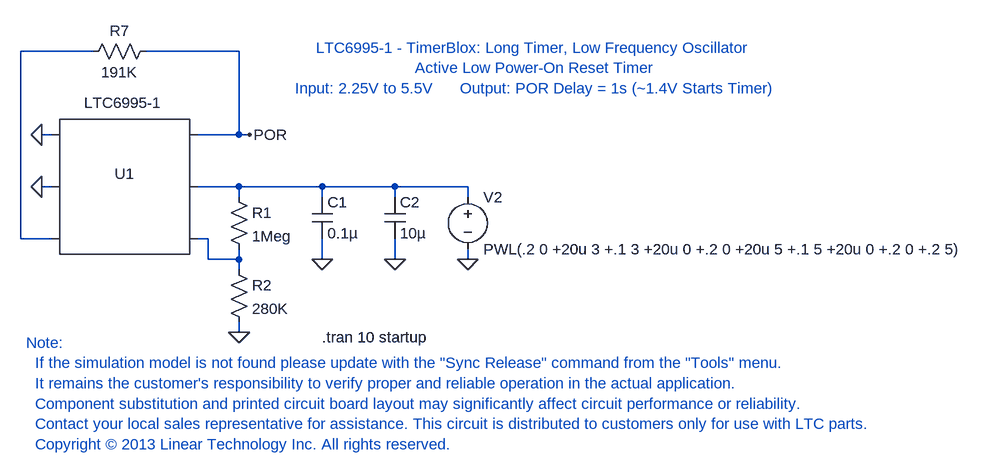
[diagram p0: schematic LTC6995-1_F12.asc]
LTC6995-1_F12.asc, the LTspice schematic file:
Version 4
SHEET 1 1636 680
WIRE 64 -160 -48 -160
WIRE 288 -160 144 -160
WIRE 0 -32 -16 -32
WIRE 288 -32 288 -160
WIRE 288 -32 224 -32
WIRE 304 -32 288 -32
WIRE 0 48 -16 48
WIRE 288 48 224 48
WIRE 416 48 288 48
WIRE 528 48 416 48
WIRE 640 48 528 48
WIRE 288 64 288 48
WIRE 416 64 416 48
WIRE 528 64 528 48
WIRE 640 64 640 48
WIRE -48 128 -48 -160
WIRE 0 128 -48 128
WIRE 240 128 224 128
WIRE 240 160 240 128
WIRE 288 160 288 144
WIRE 288 160 240 160
WIRE 416 160 416 128
WIRE 528 160 528 128
WIRE 640 160 640 144
WIRE 288 176 288 160
WIRE 288 272 288 256
FLAG 640 160 0
FLAG 288 272 0
FLAG -16 48 0
FLAG 304 -32 POR
FLAG -16 -32 0
FLAG 528 160 0
FLAG 416 160 0
SYMBOL voltage 640 48 R0
WINDOW 123 24 138 Left 2
WINDOW 39 24 117 Left 2
SYMATTR InstName V2
SYMATTR Value PWL(.2 0 +20u 3 +.1 3 +20u 0 +.2 0 +20u 5 +.1 5 +20u 0 +.2 0 +.2 5)
SYMBOL res 272 48 R0
SYMATTR InstName R1
SYMATTR Value 1Meg
SYMBOL res 272 160 R0
SYMATTR InstName R2
SYMATTR Value 280K
SYMBOL res 48 -144 R270
WINDOW 0 32 56 VTop 2
WINDOW 3 0 56 VBottom 2
SYMATTR InstName R7
SYMATTR Value 191K
SYMBOL SpecialFunctions\\LTC6995-1 112 48 R0
WINDOW 3 -2 -129 Center 2
SYMATTR InstName U1
SYMBOL cap 400 64 R0
SYMATTR InstName C1
SYMATTR Value 0.1µ
SYMBOL cap 512 64 R0
SYMATTR InstName C2
SYMATTR Value 10µ
TEXT 416 280 Left 2 !.tran 10 startup
TEXT 744 -88 Bottom 2 ;LTC6995-1 - TimerBlox: Long Timer, Low Frequency Oscillator\nActive Low Power-On Reset Timer\nInput: 2.25V to 5.5V      Output: POR Delay = 1s (~1.4V Starts Timer)
TEXT -40 288 Left 2 ;Note:\n  If the simulation model is not found please update with the "Sync Release" command from the "Tools" menu.\n  It remains the customer's responsibility to verify proper and reliable operation in the actual application.\n  Component substitution and printed circuit board layout may significantly affect circuit performance or reliability.\n  Contact your local sales representative for assistance. This circuit is distributed to customers only for use with LTC parts.\n  Copyright © 2013 Linear Technology Inc. All rights reserved.

The netlist it stands for:
* LTC6995-1_F12.asc
V2 N002 0 PWL(.2 0 +20u 3 +.1 3 +20u 0 +.2 0 +20u 5 +.1 5 +20u 0 +.2 0 +.2 5)
R1 N002 N003 1Meg
R2 N003 0 280K
R7 N001 POR 191K
XU1 0 0 N001 N003 N002 POR LTC6995-1
C1 N002 0 0.1µ
C2 N002 0 10µ
.tran 10 startup
* LTC6995-1 - TimerBlox: Long Timer, Low Frequency Oscillator
* Active Low Power-On Reset Timer
* Input: 2.25V to 5.5V      Output: POR Delay = 1s (~1.4V Starts Timer)
* Note:
*   If the simulation model is not found please update with the "Sync Release" command from the "Tools" menu.
*   It remains the customer's responsibility to verify proper and reliable operation in the actual application.
*   Component substitution and printed circuit board layout may significantly affect circuit performance or reliability.
*   Contact your local sales representative for assistance. This circuit is distributed to customers only for use with LTC parts.
*   Copyright © 2013 Linear Technology Inc. All rights reserved.
.lib LTC6995-1.sub
.backanno
.end